# Altium project PCB_Project_Transmit.PrjPCB
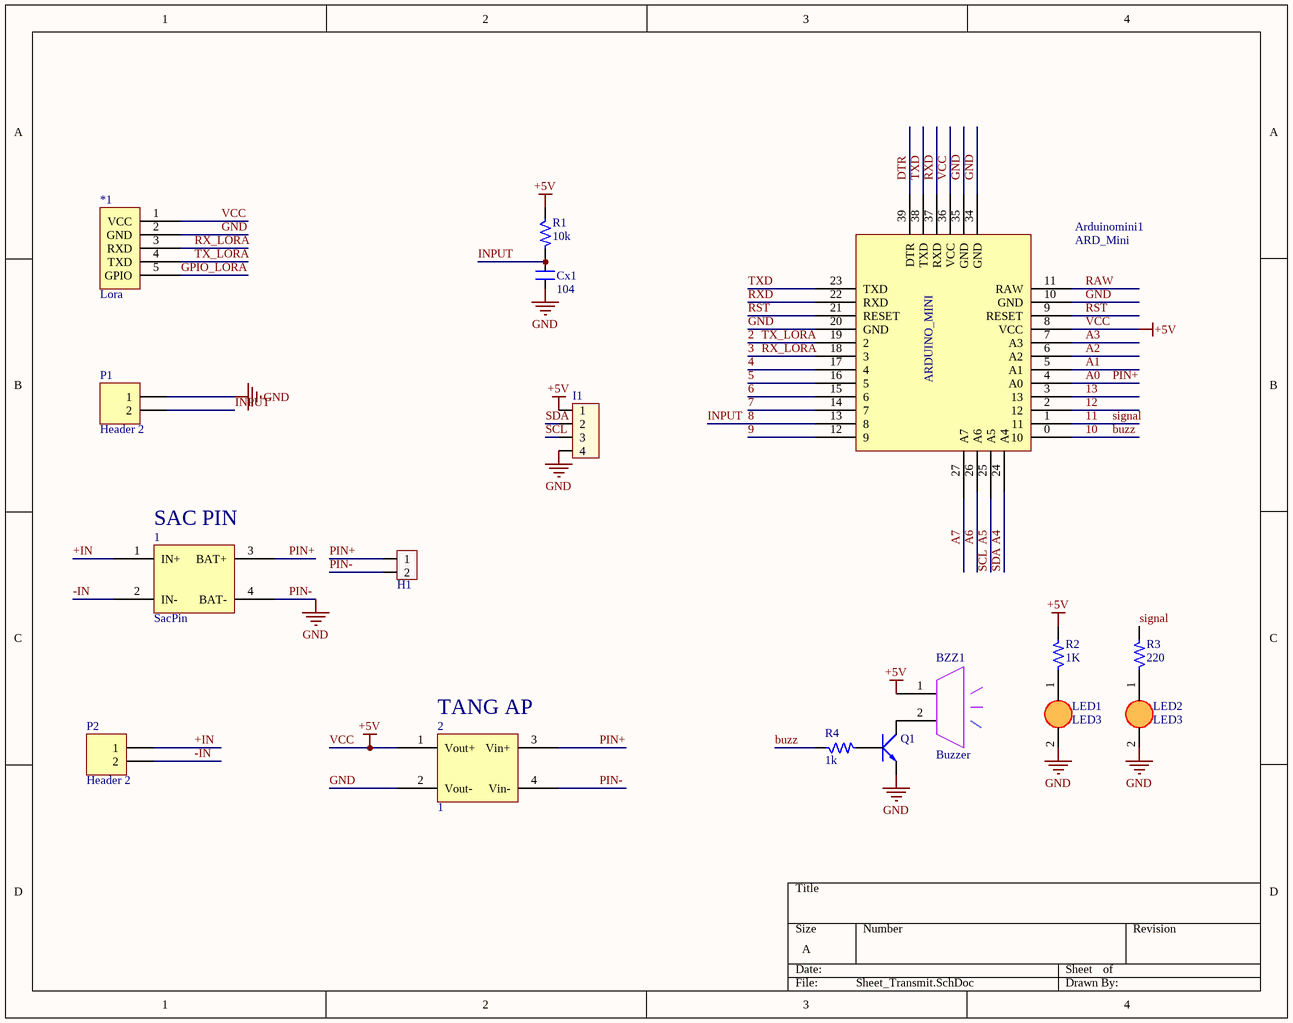
[diagram p0: Sheet_Transmit.SchDoc]
1 sheet, 17 parts. Net scope: global (net labels, ports and power ports of the same name join across sheets).
Board file: PCB_Transmit.PcbDoc

## Sheet Sheet_Transmit.SchDoc
size A

### Parts
1  SacPin  [SacPin_TP4056]
2  1  [TangAp_MT3608]
*1  Lora  [Lora]
Arduinomini1  ARD_Mini  [Arduino_mini]
BZZ1  Buzzer  [buzzer 5V]
Cx1  104  [CN1]
H1  Header2  [Header2]  (value not drawn)
I1  JP4  [CON4]  (value not drawn)
LED1  LED3  [LED3mm]
LED2  LED3  [LED3mm]
P1  Header 2  [HED2T]
P2  Header 2  [HED2T]
Q1  C1815  [QTO-92]  (value not drawn)
R1  10k  [R1/4W]
R2  1K  [R1/4W]
R3  220  [R1/4W]
R4  1k  [R1/4W]

### Nets
GND: 1.4(BAT-) 2.2(Vout-) 2.4(Vin-) *1.2(GND) Arduinomini1.10(GND) Arduinomini1.20(GND) Arduinomini1.34(GND) Arduinomini1.35(GND) Cx1.1 H1.2 I1.4 LED1.2(K) LED2.2(K) P1.1 Q1.1(E)  [also labelled PIN-]
VCC: 2.1(Vout+) *1.1(VCC) Arduinomini1.8(VCC) Arduinomini1.36(VCC) BZZ1.1 I1.1 R1.1 R2.2  [also labelled +5V]
2: *1.4(TXD) Arduinomini1.19(2)  [also labelled TX_LORA]
3: *1.3(RXD) Arduinomini1.18(3)  [also labelled RX_LORA]
4: Arduinomini1.17(4)
5: Arduinomini1.16(5)
6: Arduinomini1.15(6)
7: Arduinomini1.14(7)
8: Arduinomini1.13(8) Cx1.2 P1.2 R1.2  [also labelled INPUT]
9: Arduinomini1.12(9)
10: Arduinomini1.0(10) R4.1  [also labelled buzz]
11: Arduinomini1.1(11) R3.2  [also labelled signal]
12: Arduinomini1.2(12)
13: Arduinomini1.3(13)
+IN: 1.1(IN+) P2.1
-IN: 1.2(IN-) P2.2
A0: 1.3(BAT+) 2.3(Vin+) Arduinomini1.4(A0) H1.1  [also labelled PIN+]
A1: Arduinomini1.5(A1)
A2: Arduinomini1.6(A2)
A3: Arduinomini1.7(A3)
A4: Arduinomini1.24(A4) I1.2  [also labelled SDA]
A5: Arduinomini1.25(A5) I1.3  [also labelled SCL]
A6: Arduinomini1.26(A6)
A7: Arduinomini1.27(A7)
DTR: Arduinomini1.39(DTR)
GPIO_LORA: *1.5(GPIO)
RAW: Arduinomini1.11(RAW)
RST: Arduinomini1.9(RESET) Arduinomini1.21(RESET)
RXD: Arduinomini1.22(RXD) Arduinomini1.37(RXD)
TXD: Arduinomini1.23(TXD) Arduinomini1.38(TXD)
NetBZZ1_2: BZZ1.2 Q1.2(C)
NetLED1_1: LED1.1(A) R2.1
NetLED2_1: LED2.1(A) R3.1
NetQ1_3: Q1.3(B) R4.2

### Notes on the sheet
- (near 1) SAC PIN
- (near 2) TANG AP
- (in symbol Arduino_mini) ARDUINO_MINI

### Library data of the parts
2 = Tang Ap
Arduinomini1 = Arduino_mini
Cx1 = Cap Ceramic: Cremic For Xtal 1pF => 100pF; Value: 33pF
H1 = Header2: Header IDC, 2 x 1 Pin Vertical 2.54mm Pitch (Non-Boxed, Male)
I1 = Con4: Connector 4; Value: Connector 4
LED1 LED2 = LED 3mm
P1 P2 = Header 2: Header, 2-Pin; LatestRevisionDate: 17-Jul-2002; LatestRevisionNote: Re-released for DXP Platform.; Publisher: Altium Limited
Q1 = C1815: NPN 600mW, ECB; Value: C1815
R1 R4 = R: Resistor 1/4W; Value: R1/4W - 1K
R2 R3 = Res